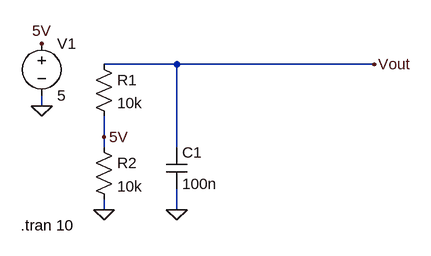
[diagram p0: schematic Draft2.asc]
Draft2.asc, the LTspice schematic file:
Version 4.1
SHEET 1 880 680
WIRE 240 64 128 64
WIRE 544 64 240 64
WIRE 32 128 32 112
WIRE 128 176 128 144
WIRE 128 192 128 176
WIRE 240 192 240 64
WIRE 128 288 128 272
WIRE 240 288 240 256
FLAG 128 288 0
FLAG 32 128 0
FLAG 32 32 5V
FLAG 128 176 5V
FLAG 240 288 0
FLAG 544 64 Vout
SYMBOL res 112 48 R0
SYMATTR InstName R1
SYMATTR Value 10k
SYMBOL res 112 176 R0
SYMATTR InstName R2
SYMATTR Value 10k
SYMBOL voltage 32 16 R0
WINDOW 123 0 0 Left 0
WINDOW 39 0 0 Left 0
SYMATTR InstName V1
SYMATTR Value 5
SYMBOL cap 224 192 R0
SYMATTR InstName C1
SYMATTR Value 100n
TEXT 0 312 Left 2 !.tran 10

The netlist it stands for:
* Draft2.asc
R1 Vout 5V 10k
R2 5V 0 10k
V1 5V 0 5
C1 Vout 0 100n
.tran 10
.backanno
.end